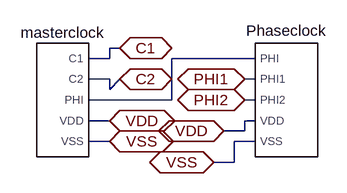
[diagram p0: schematic mainclock.asc]
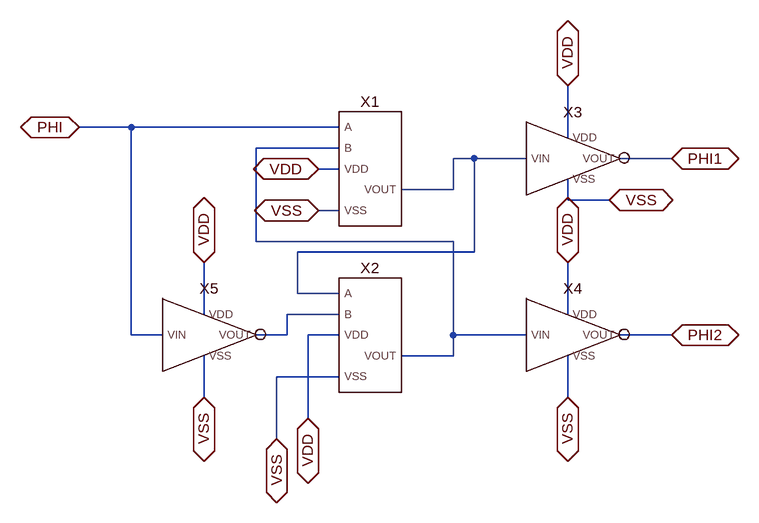
[diagram p1: sub-circuit phaseclock.asc]
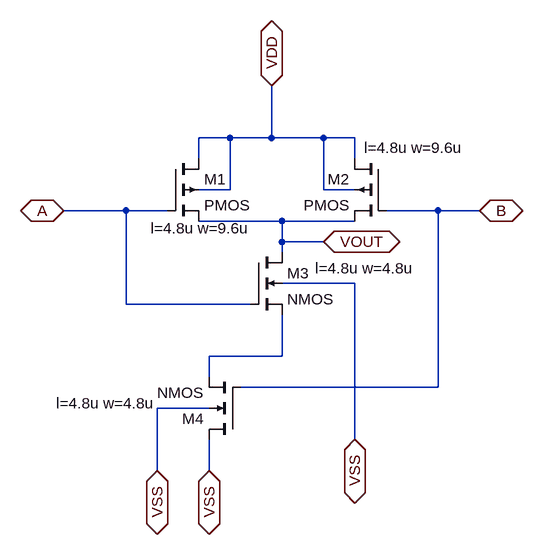
[diagram p2: sub-circuit na_nd.asc]
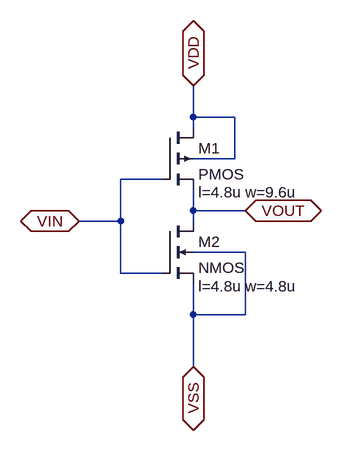
[diagram p3: sub-circuit inverter.asc]
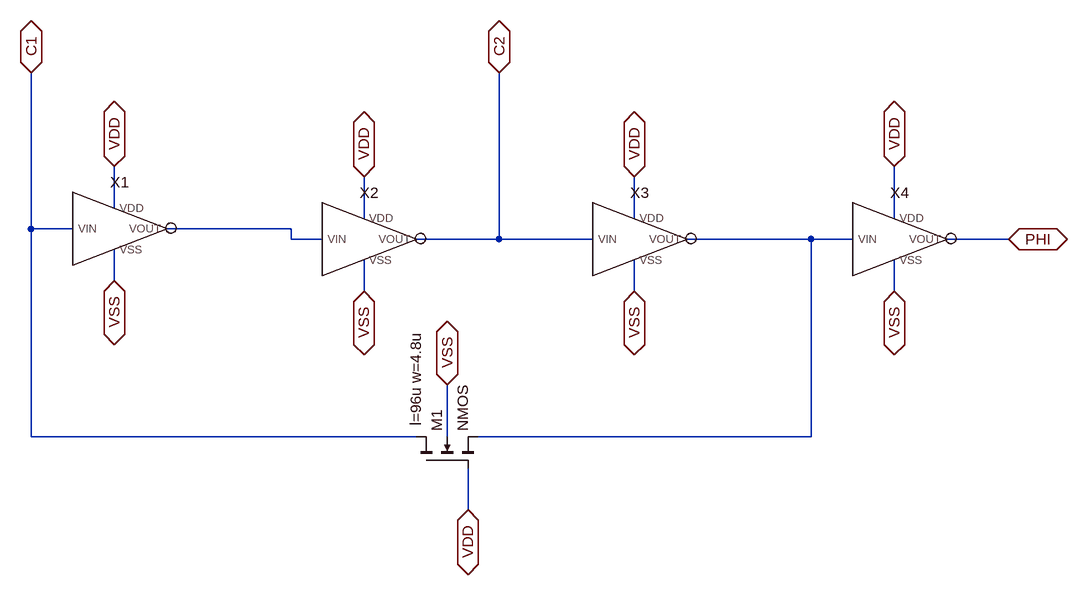
[diagram p4: sub-circuit masterclock_generator.asc]
mainclock.asc, the LTspice schematic file:
Version 4
SHEET 1 880 680
WIRE -288 272 -304 272
WIRE -304 288 -304 272
WIRE -304 288 -336 288
WIRE -80 288 -208 288
WIRE -304 320 -336 320
WIRE -80 320 -96 320
WIRE -304 336 -304 320
WIRE -304 336 -288 320
WIRE -208 352 -208 288
WIRE -208 352 -336 352
WIRE -80 352 -96 352
WIRE -304 384 -336 384
WIRE -80 384 -96 384
WIRE -96 400 -96 384
WIRE -96 400 -128 400
WIRE -304 416 -336 416
WIRE -80 416 -112 416
WIRE -112 448 -112 416
WIRE -112 448 -144 448
FLAG -304 384 VDD
IOPIN -304 384 BiDir
FLAG -304 416 VSS
IOPIN -304 416 BiDir
FLAG -128 400 VDD
IOPIN -128 400 BiDir
FLAG -144 448 VSS
IOPIN -144 448 BiDir
FLAG -96 320 PHI1
IOPIN -96 320 BiDir
FLAG -96 352 PHI2
IOPIN -96 352 BiDir
FLAG -288 272 C1
IOPIN -288 272 BiDir
FLAG -288 320 C2
IOPIN -288 320 BiDir
SYMBOL phaseclock -32 352 M0
WINDOW 0 0 -91 Bottom 2
SYMATTR InstName Phaseclock
SYMBOL masterclock_generator -384 352 R0
SYMATTR InstName masterclock

phaseclock.asc, the sub-circuit schematic file:
Version 4
SHEET 1 1016 680
WIRE -352 -160 -432 -160
WIRE -32 -160 -352 -160
WIRE 320 -144 320 -224
WIRE -32 -128 -160 -128
WIRE 176 -112 144 -112
WIRE 256 -112 176 -112
WIRE 480 -112 400 -112
WIRE -32 -96 -64 -96
WIRE 144 -64 144 -112
WIRE 144 -64 64 -64
WIRE 320 -48 320 -80
WIRE 384 -48 320 -48
WIRE -32 -32 -64 -32
WIRE -160 16 -160 -128
WIRE 144 16 -160 16
WIRE 176 32 176 -112
WIRE 176 32 -96 32
WIRE -96 96 -96 32
WIRE -32 96 -96 96
WIRE -240 128 -240 48
WIRE -32 128 -112 128
WIRE 320 128 320 48
WIRE -352 160 -352 -160
WIRE -304 160 -352 160
WIRE -112 160 -112 128
WIRE -112 160 -160 160
WIRE -32 160 -80 160
WIRE 144 160 144 16
WIRE 256 160 144 160
WIRE 480 160 400 160
WIRE 144 192 144 160
WIRE 144 192 64 192
WIRE -32 224 -128 224
WIRE -240 256 -240 192
WIRE 320 256 320 192
WIRE -80 288 -80 160
WIRE -128 320 -128 224
FLAG -432 -160 PHI
IOPIN -432 -160 BiDir
FLAG -240 48 VDD
IOPIN -240 48 BiDir
FLAG -64 -96 VDD
IOPIN -64 -96 BiDir
FLAG 320 -224 VDD
IOPIN 320 -224 BiDir
FLAG 320 48 VDD
IOPIN 320 48 BiDir
FLAG -80 288 VDD
IOPIN -80 288 BiDir
FLAG -64 -32 VSS
IOPIN -64 -32 BiDir
FLAG -128 320 VSS
IOPIN -128 320 BiDir
FLAG -240 256 VSS
IOPIN -240 256 BiDir
FLAG 320 256 VSS
IOPIN 320 256 BiDir
FLAG 384 -48 VSS
IOPIN 384 -48 BiDir
FLAG 480 -112 PHI1
IOPIN 480 -112 BiDir
FLAG 480 160 PHI2
IOPIN 480 160 BiDir
SYMBOL NA_ND 16 -96 M0
SYMATTR InstName X1
SYMBOL NA_ND 16 160 M0
SYMATTR InstName X2
SYMBOL Inverter 320 -112 R0
SYMATTR InstName X3
SYMBOL Inverter 320 160 R0
SYMATTR InstName X4
SYMBOL Inverter -240 160 R0
SYMATTR InstName X5

na_nd.asc, the sub-circuit schematic file:
Version 4
SHEET 1 880 680
WIRE 96 16 48 16
WIRE 160 16 160 -64
WIRE 160 16 96 16
WIRE 240 16 160 16
WIRE 288 16 240 16
WIRE 48 48 48 16
WIRE 288 48 288 16
WIRE 96 96 96 16
WIRE 96 96 48 96
WIRE 240 96 240 16
WIRE 288 96 240 96
WIRE -64 128 -160 128
WIRE 0 128 -64 128
WIRE 416 128 336 128
WIRE 480 128 416 128
WIRE 176 144 48 144
WIRE 288 144 176 144
WIRE 176 176 176 144
WIRE 240 176 176 176
WIRE 176 192 176 176
WIRE 288 240 176 240
WIRE -64 272 -64 128
WIRE 128 272 -64 272
WIRE 176 352 176 288
WIRE 176 352 64 352
WIRE 64 384 64 352
WIRE 416 400 416 128
WIRE 416 400 112 400
WIRE 64 432 -16 432
WIRE 288 480 288 240
WIRE -16 528 -16 432
WIRE 64 528 64 480
FLAG 240 176 VOUT
IOPIN 240 176 BiDir
FLAG 480 128 B
IOPIN 480 128 BiDir
FLAG 160 -64 VDD
IOPIN 160 -64 BiDir
FLAG -160 128 A
IOPIN -160 128 BiDir
FLAG -16 528 VSS
IOPIN -16 528 BiDir
FLAG 64 528 VSS
IOPIN 64 528 BiDir
FLAG 288 480 VSS
IOPIN 288 480 BiDir
SYMBOL pmos4 0 48 R0
WINDOW 123 -26 107 Left 2
SYMATTR Value2 l=4.8u w=9.6u
SYMATTR InstName M1
SYMBOL pmos4 336 48 M0
WINDOW 123 -119 -17 Left 2
SYMATTR Value2 l=4.8u w=9.6u
SYMATTR InstName M2
SYMBOL nmos4 128 192 R0
WINDOW 123 99 25 Left 2
SYMATTR Value2 l=4.8u w=4.8u
SYMATTR InstName M3
SYMBOL nmos4 112 480 R180
WINDOW 123 131 56 Left 2
SYMATTR Value2 l=4.8u w=4.8u
SYMATTR InstName M4

inverter.asc, the sub-circuit schematic file:
Version 4
SHEET 1 880 680
WIRE 240 0 240 -48
WIRE 304 0 240 0
WIRE 240 16 240 0
WIRE 304 64 304 0
WIRE 304 64 240 64
WIRE 192 96 128 96
WIRE 240 144 240 112
WIRE 320 144 240 144
WIRE 128 160 128 96
WIRE 128 160 64 160
WIRE 240 160 240 144
WIRE 320 208 240 208
WIRE 128 240 128 160
WIRE 192 240 128 240
WIRE 240 304 240 256
WIRE 320 304 320 208
WIRE 320 304 240 304
WIRE 240 384 240 304
FLAG 64 160 VIN
IOPIN 64 160 BiDir
FLAG 320 144 VOUT
IOPIN 320 144 BiDir
FLAG 240 -48 VDD
IOPIN 240 -48 BiDir
FLAG 240 384 VSS
IOPIN 240 384 BiDir
SYMBOL pmos4 192 16 R0
WINDOW 123 56 100 Left 2
SYMATTR Value2 l=4.8u w=9.6u
SYMATTR InstName M1
SYMBOL nmos4 192 160 R0
WINDOW 123 56 100 Left 2
SYMATTR Value2 l=4.8u w=4.8u
SYMATTR InstName M2

masterclock_generator.asc, the sub-circuit schematic file:
Version 4
SHEET 1 984 680
WIRE -496 64 -496 0
WIRE -112 80 -112 16
WIRE 304 80 304 16
WIRE 704 80 704 0
WIRE -624 96 -624 -144
WIRE -560 96 -624 96
WIRE -224 96 -416 96
WIRE -224 112 -224 96
WIRE -176 112 -224 112
WIRE 96 112 96 -144
WIRE 96 112 -32 112
WIRE 240 112 96 112
WIRE 576 112 384 112
WIRE 640 112 576 112
WIRE 880 112 784 112
WIRE -496 176 -496 128
WIRE -112 192 -112 144
WIRE 304 192 304 144
WIRE 704 192 704 144
WIRE -624 416 -624 96
WIRE -32 416 -624 416
WIRE 16 416 16 336
WIRE 576 416 576 112
WIRE 576 416 64 416
WIRE 48 528 48 464
FLAG 880 112 PHI
IOPIN 880 112 BiDir
FLAG 96 -144 C2
IOPIN 96 -144 BiDir
FLAG -624 -144 C1
IOPIN -624 -144 BiDir
FLAG -496 0 VDD
IOPIN -496 0 BiDir
FLAG -112 16 VDD
IOPIN -112 16 BiDir
FLAG 304 16 VDD
IOPIN 304 16 BiDir
FLAG 704 0 VDD
IOPIN 704 0 BiDir
FLAG -496 176 VSS
IOPIN -496 176 BiDir
FLAG -112 192 VSS
IOPIN -112 192 BiDir
FLAG 304 192 VSS
IOPIN 304 192 BiDir
FLAG 704 192 VSS
IOPIN 704 192 BiDir
FLAG 48 528 VDD
IOPIN 48 528 BiDir
FLAG 16 336 VSS
IOPIN 16 336 BiDir
SYMBOL Inverter -496 96 R0
SYMATTR InstName X1
SYMBOL Inverter -112 112 R0
SYMATTR InstName X2
SYMBOL Inverter 304 112 R0
SYMATTR InstName X3
SYMBOL Inverter 704 112 R0
SYMATTR InstName X4
SYMBOL nmos4 -32 464 R270
WINDOW 123 65 0 Left 2
SYMATTR InstName M1
SYMATTR Value2 l=96u w=4.8u

The netlist it stands for:
* mainclock.asc
XPhaseclock N001 PHI1 PHI2 VDD VSS phaseclock
Xmasterclock C1 C2 N001 VDD VSS masterclock_generator

* block symbol definitions
.subckt phaseclock PHI PHI1 PHI2 VDD VSS
XX1 PHI N001 VDD N002 VSS na_nd
XX2 N002 N003 VDD N001 VSS na_nd
XX3 VDD N002 VSS PHI1 inverter
XX4 VDD N001 VSS PHI2 inverter
XX5 VDD PHI VSS N003 inverter
.ends phaseclock

.subckt na_nd A B VDD VOUT VSS
M1 VDD A VOUT VDD PMOS l=4.8u w=9.6u
M2 VDD B VOUT VDD PMOS l=4.8u w=9.6u
M3 VOUT A N001 VSS NMOS l=4.8u w=4.8u
M4 VSS B N001 VSS NMOS l=4.8u w=4.8u
.ends na_nd

.subckt inverter VDD VIN VSS VOUT
M1 VDD VIN VOUT VDD PMOS l=4.8u w=9.6u
M2 VOUT VIN VSS VSS NMOS l=4.8u w=4.8u
.ends inverter

.subckt masterclock_generator C1 C2 PHI VDD VSS
XX1 VDD C1 VSS N001 inverter
XX2 VDD N001 VSS C2 inverter
XX3 VDD C2 VSS N002 inverter
XX4 VDD N002 VSS PHI inverter
M1 C1 VDD N002 VSS NMOS l=96u w=4.8u
.ends masterclock_generator

.model NMOS NMOS
.model PMOS PMOS
.lib standard.mos
.backanno
.end